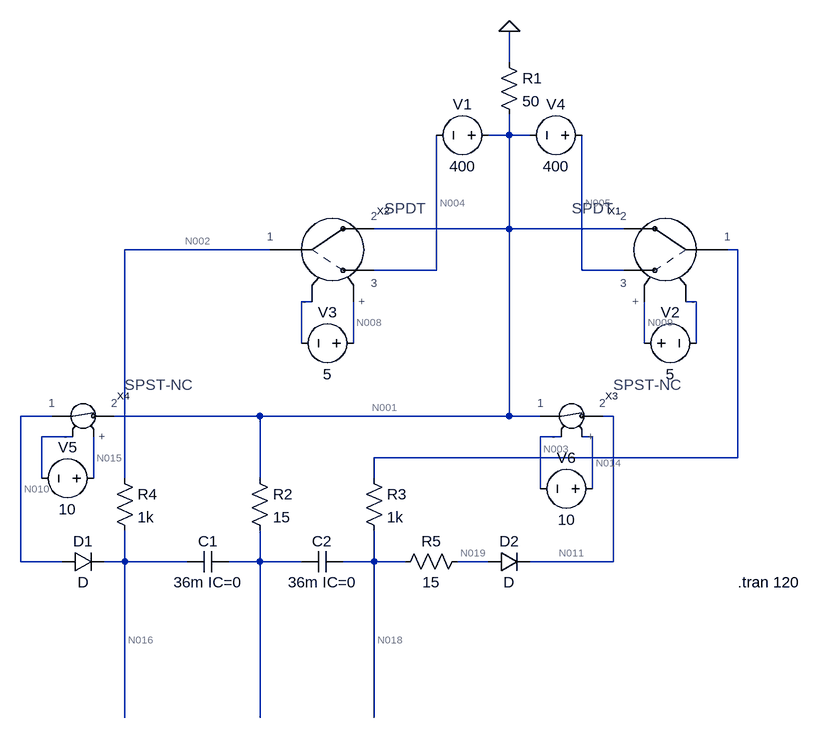
[diagram p0: schematic CUTE_X_Voltage_Circuit_Modified.asc]
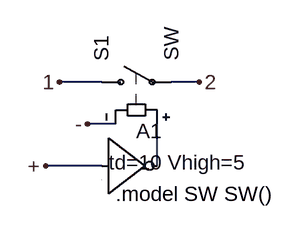
[diagram p1: sub-circuit spst-nc.asc]
CUTE_X_Voltage_Circuit_Modified.asc, the LTspice schematic file:
Version 4
SHEET 1 1048 1176
WIRE 224 -48 224 -96
WIRE 224 64 224 32
WIRE 224 64 192 64
WIRE 256 64 224 64
WIRE 224 208 224 64
WIRE 224 208 16 208
WIRE 400 208 224 208
WIRE -144 240 -368 240
WIRE 576 240 560 240
WIRE 112 272 112 64
WIRE 112 272 16 272
WIRE 336 272 336 64
WIRE 400 272 336 272
WIRE -80 320 -96 320
WIRE 512 320 496 320
WIRE -96 384 -96 320
WIRE -16 384 -16 320
WIRE 432 384 432 320
WIRE 512 384 512 320
WIRE -480 496 -528 496
WIRE -160 496 -384 496
WIRE 224 496 224 208
WIRE 224 496 -160 496
WIRE 272 496 224 496
WIRE 384 496 368 496
WIRE -448 528 -496 528
WIRE 304 528 272 528
WIRE 352 528 336 528
WIRE 576 560 576 240
WIRE 576 560 16 560
WIRE -496 592 -496 528
WIRE -416 592 -416 528
WIRE -368 592 -368 240
WIRE -160 592 -160 496
WIRE 16 592 16 560
WIRE 272 608 272 528
WIRE 352 608 352 528
WIRE -528 720 -528 496
WIRE -464 720 -528 720
WIRE -368 720 -368 672
WIRE -368 720 -400 720
WIRE -272 720 -368 720
WIRE -160 720 -160 672
WIRE -160 720 -208 720
WIRE -96 720 -160 720
WIRE 16 720 16 672
WIRE 16 720 -32 720
WIRE 64 720 16 720
WIRE 192 720 144 720
WIRE 384 720 384 496
WIRE 384 720 256 720
WIRE -368 960 -368 720
WIRE -160 960 -160 720
WIRE 16 960 16 720
FLAG 224 -96 0
SYMBOL voltage 208 64 R90
WINDOW 0 -32 56 VBottom 2
WINDOW 3 32 56 VTop 2
WINDOW 123 0 0 Left 0
WINDOW 39 0 0 Left 0
SYMATTR InstName V1
SYMATTR Value 400
SYMBOL res 208 -64 R0
SYMATTR InstName R1
SYMATTR Value 50
SYMBOL voltage 416 384 R270
WINDOW 0 32 56 VTop 2
WINDOW 3 -32 56 VBottom 2
WINDOW 123 0 0 Left 0
WINDOW 39 0 0 Left 0
SYMATTR InstName V2
SYMATTR Value 5
SYMBOL voltage 0 384 R90
WINDOW 0 -32 56 VBottom 2
WINDOW 3 32 56 VTop 2
WINDOW 123 0 0 Left 0
WINDOW 39 0 0 Left 0
SYMATTR InstName V3
SYMATTR Value 5
SYMBOL voltage 352 64 R90
WINDOW 0 -32 56 VBottom 2
WINDOW 3 32 56 VTop 2
WINDOW 123 0 0 Left 0
WINDOW 39 0 0 Left 0
SYMATTR InstName V4
SYMATTR Value 400
SYMBOL diode -464 736 R270
WINDOW 0 32 32 VTop 2
WINDOW 3 0 32 VBottom 2
SYMATTR InstName D1
SYMBOL diode 192 736 R270
WINDOW 0 32 32 VTop 2
WINDOW 3 0 32 VBottom 2
SYMATTR InstName D2
SYMBOL res -384 576 R0
SYMATTR InstName R4
SYMATTR Value 1k
SYMBOL res -176 576 R0
SYMATTR InstName R2
SYMATTR Value 15
SYMBOL res 0 576 R0
SYMATTR InstName R3
SYMATTR Value 1k
SYMBOL res 160 704 R90
WINDOW 0 0 56 VBottom 2
WINDOW 3 32 56 VTop 2
SYMATTR InstName R5
SYMATTR Value 15
SYMBOL voltage -400 592 R90
WINDOW 0 -32 56 VBottom 2
WINDOW 3 32 56 VTop 2
WINDOW 123 0 0 Left 0
WINDOW 39 0 0 Left 0
SYMATTR InstName V5
SYMATTR Value 10
SYMBOL voltage 368 608 R90
WINDOW 0 -32 56 VBottom 2
WINDOW 3 32 56 VTop 2
WINDOW 123 0 0 Left 0
WINDOW 39 0 0 Left 0
SYMATTR InstName V6
SYMATTR Value 10
SYMBOL SPDT 464 240 M0
SYMATTR InstName X1
SYMBOL SPDT -48 240 R0
SYMATTR InstName X2
SYMBOL SPST-NC 320 496 R0
SYMATTR InstName X3
SYMBOL SPST-NC -432 496 R0
SYMATTR InstName X4
SYMBOL Cap -208 704 R90
WINDOW 0 0 32 VBottom 2
WINDOW 3 32 32 VTop 2
SYMATTR InstName C1
SYMATTR Value 36m IC=0
SYMBOL Cap -32 704 R90
WINDOW 0 0 32 VBottom 2
WINDOW 3 32 32 VTop 2
SYMATTR InstName C2
SYMATTR Value 36m IC=0
TEXT 576 752 Left 2 !.tran 120

spst-nc.asc, the sub-circuit schematic file:
Version 4
SHEET 1 880 680
WIRE 176 144 128 144
WIRE 288 144 256 144
WIRE 192 192 160 192
WIRE 176 240 112 240
WIRE 240 240 240 192
FLAG 112 240 +
FLAG 160 192 -
FLAG 128 144 1
FLAG 288 144 2
SYMBOL sw 160 144 R270
SYMATTR InstName S1
SYMBOL Digital\\inv 176 176 R0
WINDOW 3 8 60 Left 2
SYMATTR Value td=10 Vhigh=5
SYMATTR InstName A1
TEXT 192 272 Left 2 !.model SW SW()

The netlist it stands for:
* CUTE_X_Voltage_Circuit_Modified.asc
V1 N001 N004 400
R1 0 N001 50
V2 N009 N007 5
V3 N008 N006 5
V4 N005 N001 400
D1 N010 N016 D
D2 N019 N011 D
R4 N002 N016 1k
R2 N001 N017 15
R3 N003 N018 1k
R5 N019 N018 15
V5 N015 N012 10
V6 N014 N013 10
XX1 N007 N009 N005 N001 N003 SPDT  ; pins - + 3 2 1
XX2 N006 N008 N004 N001 N002 SPDT  ; pins - + 3 2 1
XX3 N001 N011 N013 N014 spst-nc
XX4 N010 N001 N012 N015 spst-nc
C1 N017 N016 36m IC=0
C2 N018 N017 36m IC=0

* block symbol definitions
.subckt spst-nc 1 2 - +
S1 1 2 N001 - SW
A1 + 0 0 0 0 N001 0 0 BUF td=10 Vhigh=5
.model SW SW()
.ends spst-nc

.model D D
.lib standard.dio
.tran 120
.backanno
.end

* Results of the author's LTspice run, read from the files saved beside the schematic
* Operating Point, zero values left out:
*   V(n004) = -400 V
*   V(n009) = 5 V
*   V(n008) = 5 V
*   V(n005) = 400 V
*   V(n010) = -163.6 µV
*   V(n016) = -399.6 µV
*   V(n019) = 399.6 µV
*   V(n011) = 163.6 µV
*   V(n002) = -399.6 V
*   V(n018) = 399.6 µV
*   V(n003) = 399.6 V
*   V(n015) = 10 V
*   V(n014) = 10 V
*   I(C1) = 399.6 mA
*   I(C2) = 399.6 mA
*   I(R4) = -399.6 mA
*   I(R3) = 399.6 mA
*   I(V1) = -399.6 mA
*   I(V4) = -399.6 mA
*   Ix(x1:3) = 399.6 mA
*   Ix(x1:2) = -799.2 pA
*   Ix(x1:1) = -399.6 mA
*   Ix(x2:3) = -399.6 mA
*   Ix(x2:2) = 799.2 pA
*   Ix(x2:1) = 399.6 mA
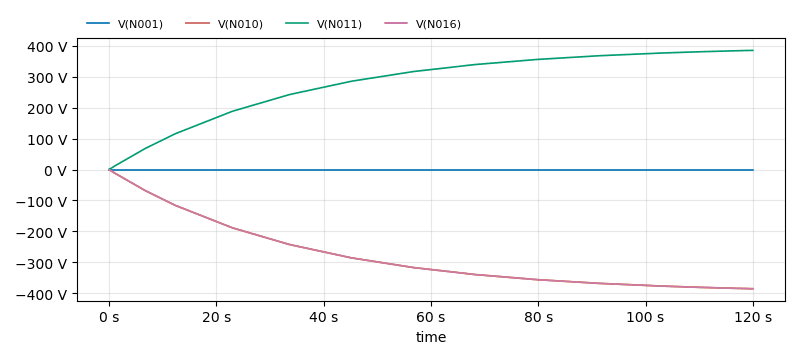
[diagram p2: Transient Analysis of CUTE_X_Voltage_Circuit_Modified.asc, plotted from the saved traces]
* Transient Analysis, 1 run:
*   V(N001): min -1.886 pV, max 6.423 pV, average 3.796 pV, rms 4.071 pV, last -852.7 fV
*   V(N010): min -385.4 V, max 0 V, average -283.2 V, rms 301.8 V, last -385.4 V
*   V(N011): min 0 V, max 385.4 V, average 283.2 V, rms 301.8 V, last 385.4 V
*   V(N016): min -385.7 V, max 0 V, average -283.5 V, rms 302.1 V, last -385.7 V